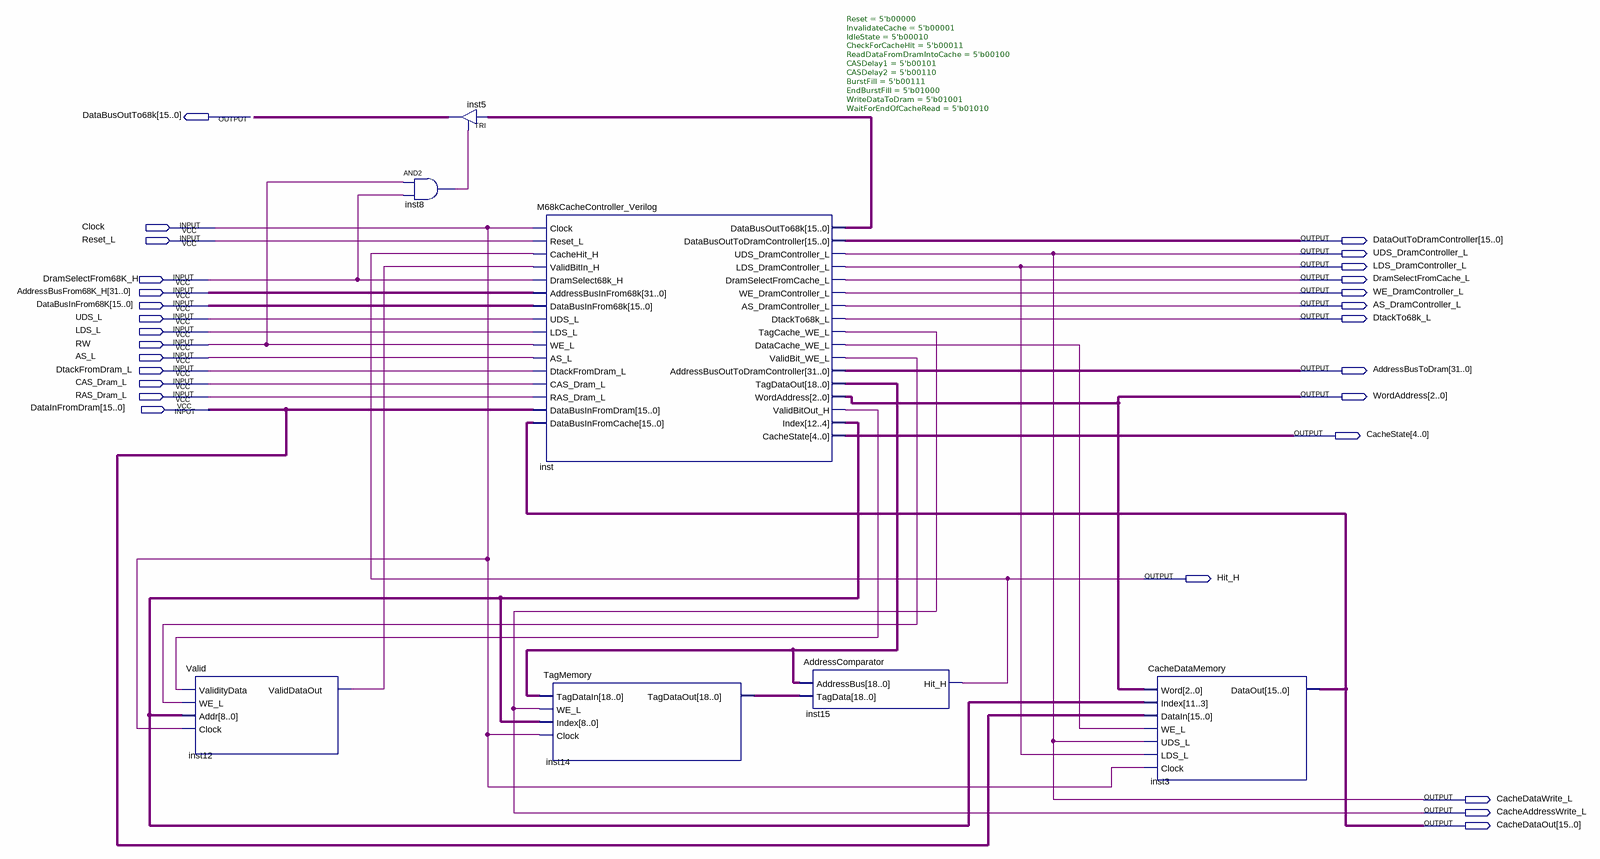
[diagram p0: schematic sheet]
// Quartus schematic DramCache.bdf as structural Verilog: 7 symbols, 28 pins
module DramCache (
  input  Clock,
  input  Reset_L,
  input  DramSelectFrom68K_H,
  input  [31:0] AddressBusFrom68K_H,
  input  [15:0] DataBusInFrom68K,
  input  UDS_L,
  input  LDS_L,
  input  RW,
  input  AS_L,
  input  DtackFromDram_L,
  input  CAS_Dram_L,
  input  RAS_Dram_L,
  input  [15:0] DataInFromDram,
  output [15:0] DataBusOutTo68k,
  output [15:0] DataOutToDramController,
  output UDS_DramController_L,
  output LDS_DramController_L,
  output DramSelectFromCache_L,
  output WE_DramController_L,
  output AS_DramController_L,
  output DtackTo68k_L,
  output [31:0] AddressBusToDram,
  output [2:0] WordAddress,
  output [4:0] CacheState,
  output Hit_H,
  output CacheDataWrite_L,
  output CacheAddressWrite_L,
  output [15:0] CacheDataOut
);

  wire inst8_out, inst12_validdataout, inst_datacache_we_l, inst_validbit_we_l, inst_validbitout_h;
  wire [8:0] inst_index;
  wire [15:0] inst_databusoutto68k;
  wire [18:0] inst14_tagdataout, inst_tagdataout;

  Valid inst12 (
    .ValidityData(inst_validbitout_h), .WE_L(inst_validbit_we_l), .Addr(inst_index), .Clock(Clock),
    .ValidDataOut(inst12_validdataout));
  and inst8 (inst8_out, RW, DramSelectFrom68K_H);
  TRI inst5[15:0] (.IN(inst_databusoutto68k), .OE(inst8_out), .OUT(DataBusOutTo68k));
  M68kCacheController_Verilog #(.Reset(5'b00000), .InvalidateCache(5'b00001), .IdleState(5'b00010), .CheckForCacheHit(5'b00011), .ReadDataFromDramIntoCache(5'b00100), .CASDelay1(5'b00101), .CASDelay2(5'b00110), .BurstFill(5'b00111), .EndBurstFill(5'b01000), .WriteDataToDram(5'b01001), .WaitForEndOfCacheRead(5'b01010)) inst (
    .Clock(Clock), .Reset_L(Reset_L), .CacheHit_H(Hit_H), .ValidBitIn_H(inst12_validdataout),
    .DramSelect68k_H(DramSelectFrom68K_H), .AddressBusInFrom68k(AddressBusFrom68K_H),
    .DataBusInFrom68k(DataBusInFrom68K), .UDS_L(UDS_L), .LDS_L(LDS_L), .WE_L(RW), .AS_L(AS_L),
    .DtackFromDram_L(DtackFromDram_L), .CAS_Dram_L(CAS_Dram_L), .RAS_Dram_L(RAS_Dram_L),
    .DataBusInFromDram(DataInFromDram), .DataBusInFromCache(CacheDataOut),
    .DataBusOutTo68k(inst_databusoutto68k), .DataBusOutToDramController(DataOutToDramController),
    .UDS_DramController_L(CacheDataWrite_L), .LDS_DramController_L(LDS_DramController_L),
    .DramSelectFromCache_L(DramSelectFromCache_L), .WE_DramController_L(WE_DramController_L),
    .AS_DramController_L(AS_DramController_L), .DtackTo68k_L(DtackTo68k_L),
    .TagCache_WE_L(CacheAddressWrite_L), .DataCache_WE_L(inst_datacache_we_l),
    .ValidBit_WE_L(inst_validbit_we_l), .AddressBusOutToDramController(AddressBusToDram),
    .TagDataOut(inst_tagdataout), .WordAddress(WordAddress), .ValidBitOut_H(inst_validbitout_h),
    .Index(inst_index), .CacheState(CacheState));
  TagMemory inst14 (
    .TagDataIn(inst_tagdataout), .WE_L(CacheAddressWrite_L), .Index(inst_index), .Clock(Clock),
    .TagDataOut(inst14_tagdataout));
  AddressComparator inst15 (.AddressBus(inst_tagdataout), .TagData(inst14_tagdataout), .Hit_H(Hit_H));
  CacheDataMemory inst3 (
    .Word(WordAddress), .Index(inst_index), .DataIn(DataInFromDram), .WE_L(inst_datacache_we_l),
    .UDS_L(CacheDataWrite_L), .LDS_L(LDS_DramController_L), .Clock(Clock), .DataOut(CacheDataOut));

  assign UDS_DramController_L = CacheDataWrite_L;
endmodule
